# Altium schematic sheet [8]-RK3399 SDRAM Page.SchDoc: RK3399 SOM Board Design V1.0
size A3; Author: ABC; Organization: Altium Limited; Address1: L3, 12a Rodborough Rd; Address2: Frenchs Forest; Address3: NSW; Address4: Australia 2086; DocumentNumber: 10; SheetNumber: 10; SheetTotal: 21; PROJECT CODE: A_V1.0
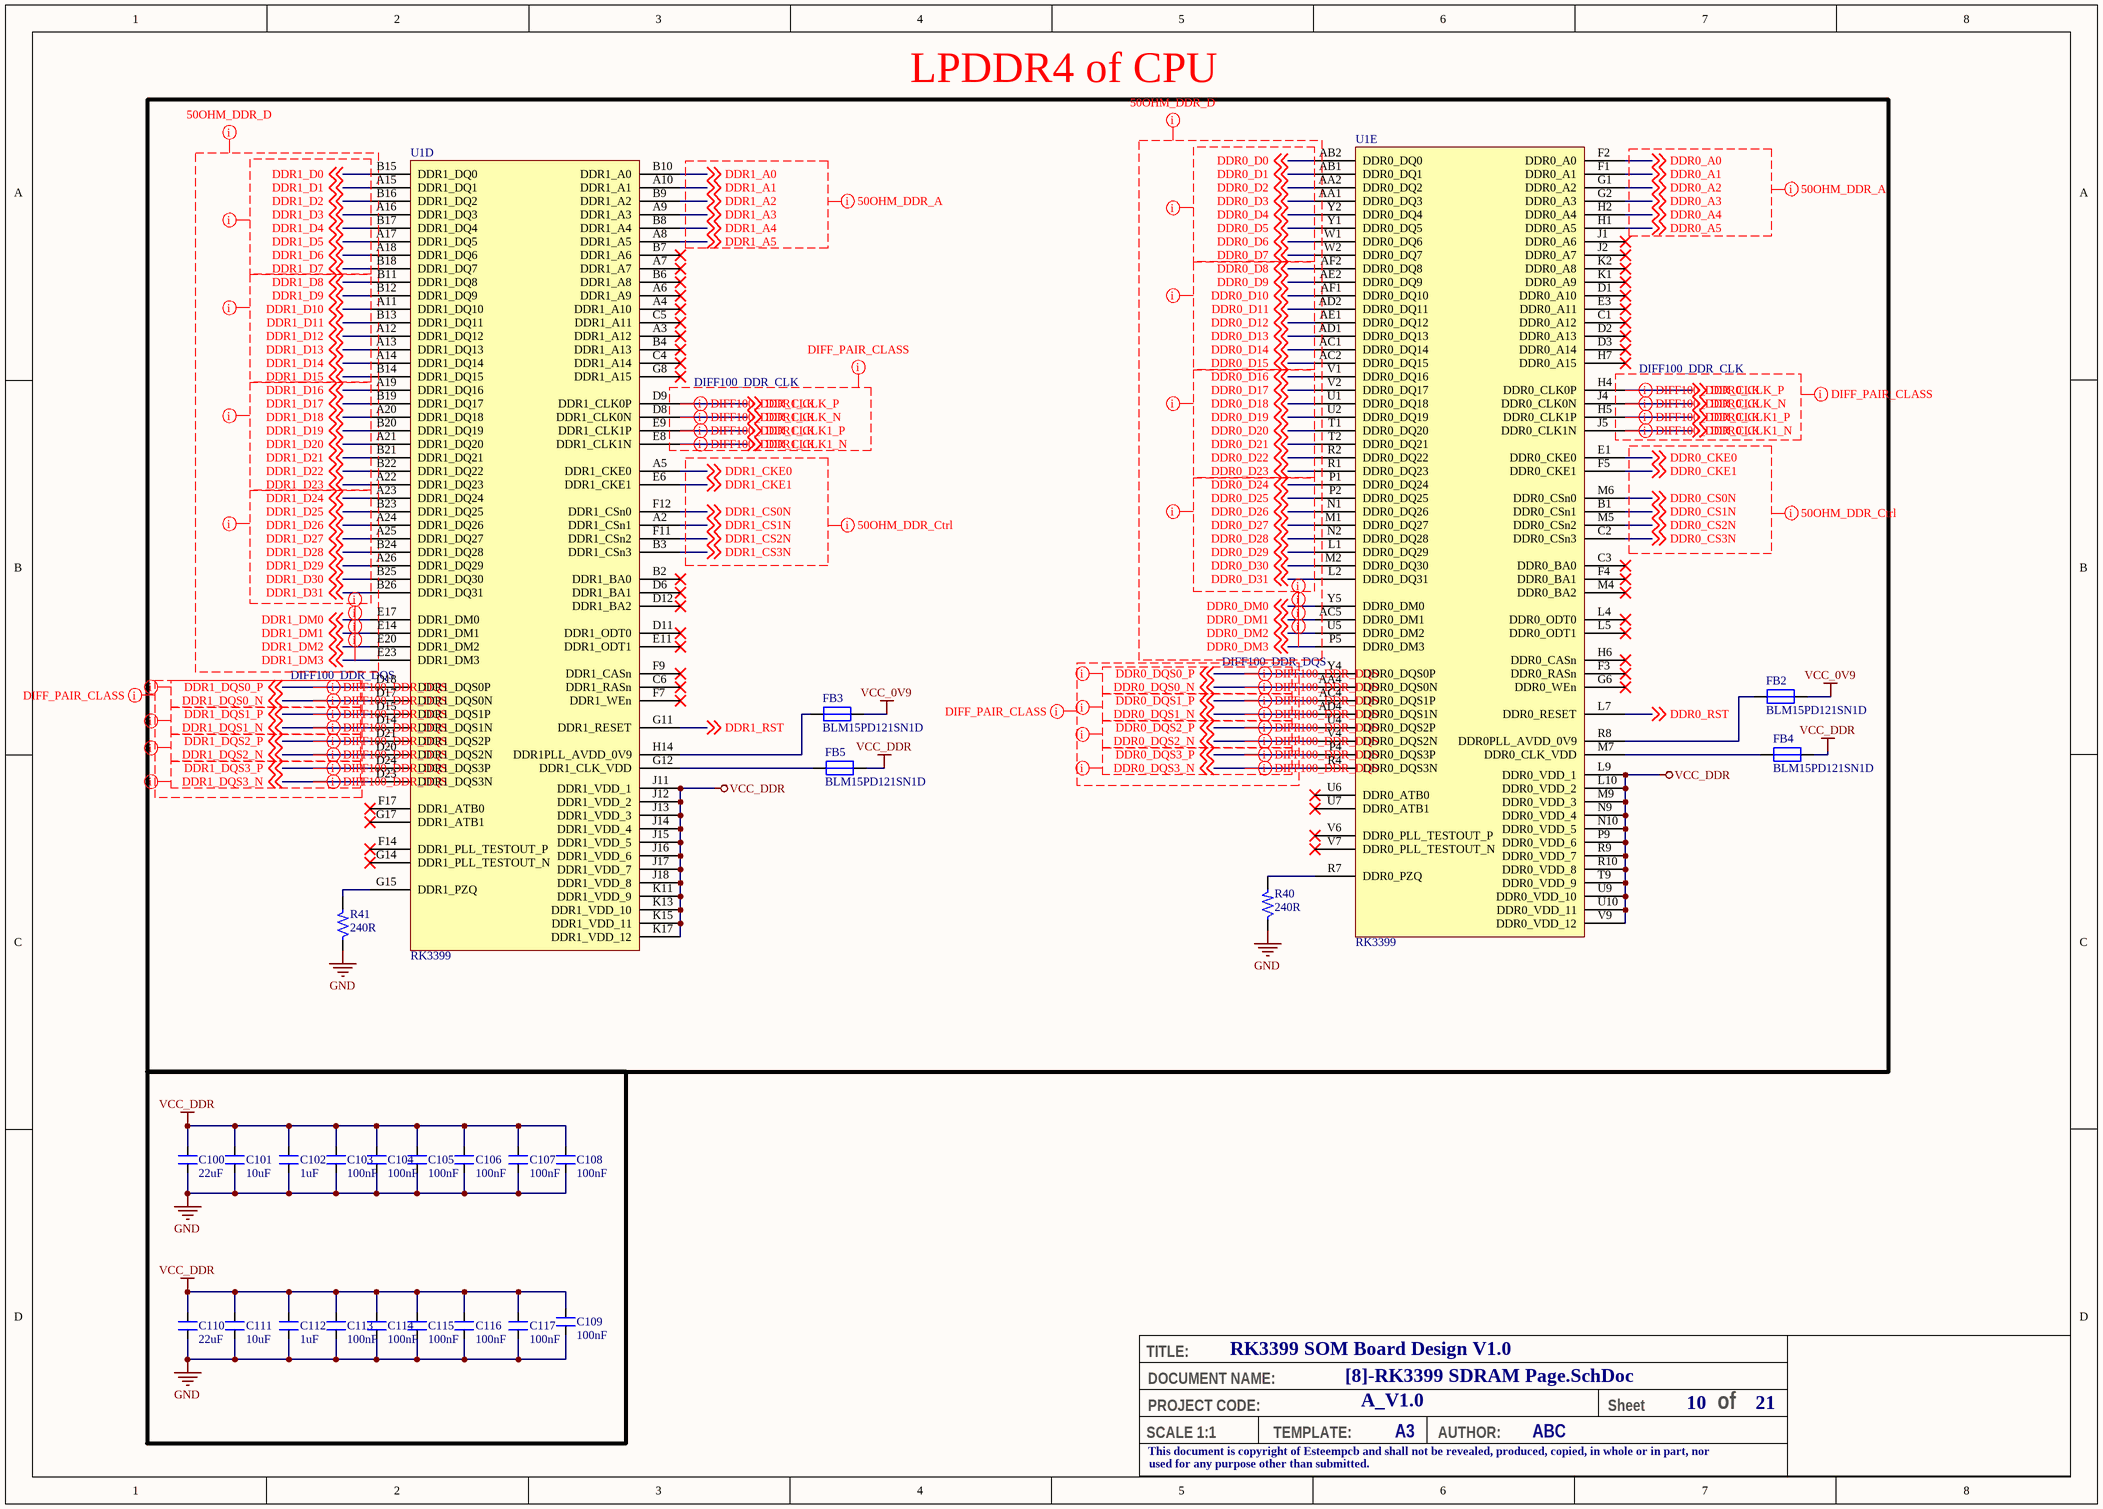
[diagram p0: [8]-RK3399 SDRAM Page.SchDoc]

## Parts
C100  22uF  [CAP_0402]
C101  10uF  [CAP_0402]
C102  1uF  [CAP_0201]
C103  100nF  [CAP_0201]
C104  100nF  [CAP_0201]
C105  100nF  [CAP_0201]
C106  100nF  [CAP_0201]
C107  100nF  [CAP_0201]
C108  100nF  [CAP_0201]
C109  100nF  [CAP_0201]
C110  22uF  [CAP_0402]
C111  10uF  [CAP_0402]
C112  1uF  [CAP_0201]
C113  100nF  [CAP_0201]
C114  100nF  [CAP_0201]
C115  100nF  [CAP_0201]
C116  100nF  [CAP_0201]
C117  100nF  [CAP_0201]
FB2  BLM15PD121SN1D  [RES_0402]
FB3  BLM15PD121SN1D  [RES_0402]
FB4  BLM15PD121SN1D  [RES_0402]
FB5  BLM15PD121SN1D  [RES_0402]
R40  240R  [RES_0201]
R41  240R  [RES_0201]
U1  RK3399  [FBGA828_23_826X826]  (parts D,E of 24)

## Blocks framed on the sheet
LPDDR4 of CPU: FB2-FB5 R40 R41 U1

## Nets
GND: C100.1 C101.1 C102.1 C103.1 C104.1 C105.1 C106.1 C107.1 C108.1 C109.1 C110.1 C111.1 C112.1 C113.1 C114.1 C115.1 C116.1 C117.1 R40.1 R41.1
VCC_0V9: FB2.2 FB3.2
VCC_DDR: C100.2 C101.2 C102.2 C103.2 C104.2 C105.2 C106.2 C107.2 C108.2 C109.2 C110.2 C111.2 C112.2 C113.2 C114.2 C115.2 C116.2 C117.2 FB4.2 FB5.2 U1.J11(DDR1_VDD_1) U1.J12(DDR1_VDD_2) U1.J13(DDR1_VDD_3) U1.J14(DDR1_VDD_4) U1.J15(DDR1_VDD_5) U1.J16(DDR1_VDD_6) U1.J17(DDR1_VDD_7) U1.J18(DDR1_VDD_8) U1.K11(DDR1_VDD_9) U1.K13(DDR1_VDD_10) U1.K15(DDR1_VDD_11) U1.K17(DDR1_VDD_12) U1.L9(DDR0_VDD_1) U1.L10(DDR0_VDD_2) U1.M9(DDR0_VDD_3) U1.N9(DDR0_VDD_4) U1.N10(DDR0_VDD_5) U1.P9(DDR0_VDD_6) U1.R9(DDR0_VDD_7) U1.R10(DDR0_VDD_8) U1.T9(DDR0_VDD_9) U1.U9(DDR0_VDD_10) U1.U10(DDR0_VDD_11) U1.V9(DDR0_VDD_12)
DDR0_A0: U1.F2(DDR0_A0) ; off-sheet DDR0_A0
DDR0_A1: U1.F1(DDR0_A1) ; off-sheet DDR0_A1
DDR0_A2: U1.G1(DDR0_A2) ; off-sheet DDR0_A2
DDR0_A3: U1.G2(DDR0_A3) ; off-sheet DDR0_A3
DDR0_A4: U1.H2(DDR0_A4) ; off-sheet DDR0_A4
DDR0_A5: U1.H1(DDR0_A5) ; off-sheet DDR0_A5
DDR0_CKE0: U1.E1(DDR0_CKE0) ; off-sheet DDR0_CKE0
DDR0_CKE1: U1.F5(DDR0_CKE1) ; off-sheet DDR0_CKE1
DDR0_CLK1_N: U1.J5(DDR0_CLK1N) ; off-sheet DDR0_CLK1_N
DDR0_CLK1_P: U1.H5(DDR0_CLK1P) ; off-sheet DDR0_CLK1_P
DDR0_CLK_N: U1.J4(DDR0_CLK0N) ; off-sheet DDR0_CLK_N
DDR0_CLK_P: U1.H4(DDR0_CLK0P) ; off-sheet DDR0_CLK_P
DDR0_CS0N: U1.M6(DDR0_CSn0) ; off-sheet DDR0_CS0N
DDR0_CS1N: U1.B1(DDR0_CSn1) ; off-sheet DDR0_CS1N
DDR0_CS2N: U1.M5(DDR0_CSn2) ; off-sheet DDR0_CS2N
DDR0_CS3N: U1.C2(DDR0_CSn3) ; off-sheet DDR0_CS3N
DDR0_D0: U1.AB2(DDR0_DQ0) ; off-sheet DDR0_D0
DDR0_D1: U1.AB1(DDR0_DQ1) ; off-sheet DDR0_D1
DDR0_D2: U1.AA2(DDR0_DQ2) ; off-sheet DDR0_D2
DDR0_D3: U1.AA1(DDR0_DQ3) ; off-sheet DDR0_D3
DDR0_D4: U1.Y2(DDR0_DQ4) ; off-sheet DDR0_D4
DDR0_D5: U1.Y1(DDR0_DQ5) ; off-sheet DDR0_D5
DDR0_D6: U1.W1(DDR0_DQ6) ; off-sheet DDR0_D6
DDR0_D7: U1.W2(DDR0_DQ7) ; off-sheet DDR0_D7
DDR0_D8: U1.AF2(DDR0_DQ8) ; off-sheet DDR0_D8
DDR0_D9: U1.AE2(DDR0_DQ9) ; off-sheet DDR0_D9
DDR0_D10: U1.AF1(DDR0_DQ10) ; off-sheet DDR0_D10
DDR0_D11: U1.AD2(DDR0_DQ11) ; off-sheet DDR0_D11
DDR0_D12: U1.AE1(DDR0_DQ12) ; off-sheet DDR0_D12
DDR0_D13: U1.AD1(DDR0_DQ13) ; off-sheet DDR0_D13
DDR0_D14: U1.AC1(DDR0_DQ14) ; off-sheet DDR0_D14
DDR0_D15: U1.AC2(DDR0_DQ15) ; off-sheet DDR0_D15
DDR0_D16: U1.V1(DDR0_DQ16) ; off-sheet DDR0_D16
DDR0_D17: U1.V2(DDR0_DQ17) ; off-sheet DDR0_D17
DDR0_D18: U1.U1(DDR0_DQ18) ; off-sheet DDR0_D18
DDR0_D19: U1.U2(DDR0_DQ19) ; off-sheet DDR0_D19
DDR0_D20: U1.T1(DDR0_DQ20) ; off-sheet DDR0_D20
DDR0_D21: U1.T2(DDR0_DQ21) ; off-sheet DDR0_D21
DDR0_D22: U1.R2(DDR0_DQ22) ; off-sheet DDR0_D22
DDR0_D23: U1.R1(DDR0_DQ23) ; off-sheet DDR0_D23
DDR0_D24: U1.P1(DDR0_DQ24) ; off-sheet DDR0_D24
DDR0_D25: U1.P2(DDR0_DQ25) ; off-sheet DDR0_D25
DDR0_D26: U1.N1(DDR0_DQ26) ; off-sheet DDR0_D26
DDR0_D27: U1.M1(DDR0_DQ27) ; off-sheet DDR0_D27
DDR0_D28: U1.N2(DDR0_DQ28) ; off-sheet DDR0_D28
DDR0_D29: U1.L1(DDR0_DQ29) ; off-sheet DDR0_D29
DDR0_D30: U1.M2(DDR0_DQ30) ; off-sheet DDR0_D30
DDR0_D31: U1.L2(DDR0_DQ31) ; off-sheet DDR0_D31
DDR0_DM0: U1.Y5(DDR0_DM0) ; off-sheet DDR0_DM0
DDR0_DM1: U1.AC5(DDR0_DM1) ; off-sheet DDR0_DM1
DDR0_DM2: U1.U5(DDR0_DM2) ; off-sheet DDR0_DM2
DDR0_DM3: U1.P5(DDR0_DM3) ; off-sheet DDR0_DM3
DDR0_DQS0_N: U1.AA4(DDR0_DQS0N) ; off-sheet DDR0_DQS0_N
DDR0_DQS0_P: U1.Y4(DDR0_DQS0P) ; off-sheet DDR0_DQS0_P
DDR0_DQS1_N: U1.AD4(DDR0_DQS1N) ; off-sheet DDR0_DQS1_N
DDR0_DQS1_P: U1.AC4(DDR0_DQS1P) ; off-sheet DDR0_DQS1_P
DDR0_DQS2_N: U1.V4(DDR0_DQS2N) ; off-sheet DDR0_DQS2_N
DDR0_DQS2_P: U1.U4(DDR0_DQS2P) ; off-sheet DDR0_DQS2_P
DDR0_DQS3_N: U1.R4(DDR0_DQS3N) ; off-sheet DDR0_DQS3_N
DDR0_DQS3_P: U1.P4(DDR0_DQS3P) ; off-sheet DDR0_DQS3_P
DDR0_RST: U1.L7(DDR0_RESET) ; off-sheet DDR0_RST
DDR1_A0: U1.B10(DDR1_A0) ; off-sheet DDR1_A0
DDR1_A1: U1.A10(DDR1_A1) ; off-sheet DDR1_A1
DDR1_A2: U1.B9(DDR1_A2) ; off-sheet DDR1_A2
DDR1_A3: U1.A9(DDR1_A3) ; off-sheet DDR1_A3
DDR1_A4: U1.B8(DDR1_A4) ; off-sheet DDR1_A4
DDR1_A5: U1.A8(DDR1_A5) ; off-sheet DDR1_A5
DDR1_CKE0: U1.A5(DDR1_CKE0) ; off-sheet DDR1_CKE0
DDR1_CKE1: U1.E6(DDR1_CKE1) ; off-sheet DDR1_CKE1
DDR1_CLK1_N: U1.E8(DDR1_CLK1N) ; off-sheet DDR1_CLK1_N
DDR1_CLK1_P: U1.E9(DDR1_CLK1P) ; off-sheet DDR1_CLK1_P
DDR1_CLK_N: U1.D8(DDR1_CLK0N) ; off-sheet DDR1_CLK_N
DDR1_CLK_P: U1.D9(DDR1_CLK0P) ; off-sheet DDR1_CLK_P
DDR1_CS0N: U1.F12(DDR1_CSn0) ; off-sheet DDR1_CS0N
DDR1_CS1N: U1.A2(DDR1_CSn1) ; off-sheet DDR1_CS1N
DDR1_CS2N: U1.F11(DDR1_CSn2) ; off-sheet DDR1_CS2N
DDR1_CS3N: U1.B3(DDR1_CSn3) ; off-sheet DDR1_CS3N
DDR1_D0: U1.B15(DDR1_DQ0) ; off-sheet DDR1_D0
DDR1_D1: U1.A15(DDR1_DQ1) ; off-sheet DDR1_D1
DDR1_D2: U1.B16(DDR1_DQ2) ; off-sheet DDR1_D2
DDR1_D3: U1.A16(DDR1_DQ3) ; off-sheet DDR1_D3
DDR1_D4: U1.B17(DDR1_DQ4) ; off-sheet DDR1_D4
DDR1_D5: U1.A17(DDR1_DQ5) ; off-sheet DDR1_D5
DDR1_D6: U1.A18(DDR1_DQ6) ; off-sheet DDR1_D6
DDR1_D7: U1.B18(DDR1_DQ7) ; off-sheet DDR1_D7
DDR1_D8: U1.B11(DDR1_DQ8) ; off-sheet DDR1_D8
DDR1_D9: U1.B12(DDR1_DQ9) ; off-sheet DDR1_D9
DDR1_D10: U1.A11(DDR1_DQ10) ; off-sheet DDR1_D10
DDR1_D11: U1.B13(DDR1_DQ11) ; off-sheet DDR1_D11
DDR1_D12: U1.A12(DDR1_DQ12) ; off-sheet DDR1_D12
DDR1_D13: U1.A13(DDR1_DQ13) ; off-sheet DDR1_D13
DDR1_D14: U1.A14(DDR1_DQ14) ; off-sheet DDR1_D14
DDR1_D15: U1.B14(DDR1_DQ15) ; off-sheet DDR1_D15
DDR1_D16: U1.A19(DDR1_DQ16) ; off-sheet DDR1_D16
DDR1_D17: U1.B19(DDR1_DQ17) ; off-sheet DDR1_D17
DDR1_D18: U1.A20(DDR1_DQ18) ; off-sheet DDR1_D18
DDR1_D19: U1.B20(DDR1_DQ19) ; off-sheet DDR1_D19
DDR1_D20: U1.A21(DDR1_DQ20) ; off-sheet DDR1_D20
DDR1_D21: U1.B21(DDR1_DQ21) ; off-sheet DDR1_D21
DDR1_D22: U1.B22(DDR1_DQ22) ; off-sheet DDR1_D22
DDR1_D23: U1.A22(DDR1_DQ23) ; off-sheet DDR1_D23
DDR1_D24: U1.A23(DDR1_DQ24) ; off-sheet DDR1_D24
DDR1_D25: U1.B23(DDR1_DQ25) ; off-sheet DDR1_D25
DDR1_D26: U1.A24(DDR1_DQ26) ; off-sheet DDR1_D26
DDR1_D27: U1.A25(DDR1_DQ27) ; off-sheet DDR1_D27
DDR1_D28: U1.B24(DDR1_DQ28) ; off-sheet DDR1_D28
DDR1_D29: U1.A26(DDR1_DQ29) ; off-sheet DDR1_D29
DDR1_D30: U1.B25(DDR1_DQ30) ; off-sheet DDR1_D30
DDR1_D31: U1.B26(DDR1_DQ31) ; off-sheet DDR1_D31
DDR1_DM0: U1.E17(DDR1_DM0) ; off-sheet DDR1_DM0
DDR1_DM1: U1.E14(DDR1_DM1) ; off-sheet DDR1_DM1
DDR1_DM2: U1.E20(DDR1_DM2) ; off-sheet DDR1_DM2
DDR1_DM3: U1.E23(DDR1_DM3) ; off-sheet DDR1_DM3
DDR1_DQS0_N: U1.D17(DDR1_DQS0N) ; off-sheet DDR1_DQS0_N
DDR1_DQS0_P: U1.D18(DDR1_DQS0P) ; off-sheet DDR1_DQS0_P
DDR1_DQS1_N: U1.D14(DDR1_DQS1N) ; off-sheet DDR1_DQS1_N
DDR1_DQS1_P: U1.D15(DDR1_DQS1P) ; off-sheet DDR1_DQS1_P
DDR1_DQS2_N: U1.D20(DDR1_DQS2N) ; off-sheet DDR1_DQS2_N
DDR1_DQS2_P: U1.D21(DDR1_DQS2P) ; off-sheet DDR1_DQS2_P
DDR1_DQS3_N: U1.D23(DDR1_DQS3N) ; off-sheet DDR1_DQS3_N
DDR1_DQS3_P: U1.D24(DDR1_DQS3P) ; off-sheet DDR1_DQS3_P
DDR1_RST: U1.G11(DDR1_RESET) ; off-sheet DDR1_RST
NetFB2_1: FB2.1 U1.R8(DDR0PLL_AVDD_0V9)
NetFB3_1: FB3.1 U1.H14(DDR1PLL_AVDD_0V9)
NetFB4_1: FB4.1 U1.M7(DDR0_CLK_VDD)
NetFB5_1: FB5.1 U1.G12(DDR1_CLK_VDD)
NetR40_2: R40.2 U1.R7(DDR0_PZQ)
NetR41_2: R41.2 U1.G15(DDR1_PZQ)

Not connected (* = marked no-connect by the designer): U1 A3(DDR1_A12)* A4(DDR1_A10)* A6(DDR1_A9)* A7(DDR1_A7)* B2(DDR1_BA0)* B4(DDR1_A13)* B6(DDR1_A8)* B7(DDR1_A6)* C1(DDR0_A12)* C3(DDR0_BA0)* C4(DDR1_A14)* C5(DDR1_A11)* C6(DDR1_RASn)* D1(DDR0_A10)* D2(DDR0_A13)* D3(DDR0_A14)* D6(DDR1_BA1)* D11(DDR1_ODT0)* D12(DDR1_BA2)* E3(DDR0_A11)* E11(DDR1_ODT1)* F3(DDR0_RASn)* F4(DDR0_BA1)* F7(DDR1_WEn)* F9(DDR1_CASn)* F14(DDR1_PLL_TESTOUT_P)* F17(DDR1_ATB0)* G6(DDR0_WEn)* G8(DDR1_A15)* G14(DDR1_PLL_TESTOUT_N)* G17(DDR1_ATB1)* H6(DDR0_CASn)* H7(DDR0_A15)* J1(DDR0_A6)* J2(DDR0_A7)* K1(DDR0_A9)* K2(DDR0_A8)* L4(DDR0_ODT0)* L5(DDR0_ODT1)* M4(DDR0_BA2)* U6(DDR0_ATB0)* U7(DDR0_ATB1)* V6(DDR0_PLL_TESTOUT_P)* V7(DDR0_PLL_TESTOUT_N)*

## Layout directives
net class 50OHM_DDR_D: DDR0_D0, DDR0_D1, DDR0_D2, DDR0_D3, DDR0_D4, DDR0_D5, DDR0_D6, DDR0_D7, DDR0_D8, DDR0_D9, DDR0_D10, DDR0_D11, DDR0_D12, DDR0_D13, DDR0_D14, DDR0_D15, DDR0_D16, DDR0_D17, DDR0_D18, DDR0_D19, DDR0_D20, DDR0_D21, DDR0_D22, DDR0_D23, DDR0_D24, DDR0_D25, DDR0_D26, DDR0_D27, DDR0_D28, DDR0_D29, DDR0_D30, DDR0_D31, DDR0_DM0, DDR0_DM1, DDR0_DM2, DDR0_DM3, DDR1_D0, DDR1_D1, DDR1_D2, DDR1_D3, DDR1_D4, DDR1_D5, DDR1_D6, DDR1_D7, DDR1_D8, DDR1_D9, DDR1_D10, DDR1_D11, DDR1_D12, DDR1_D13, DDR1_D14, DDR1_D15, DDR1_D16, DDR1_D17, DDR1_D18, DDR1_D19, DDR1_D20, DDR1_D21, DDR1_D22, DDR1_D23, DDR1_D24, DDR1_D25, DDR1_D26, DDR1_D27, DDR1_D28, DDR1_D29, DDR1_D30, DDR1_D31, DDR1_DM0, DDR1_DM1, DDR1_DM2, DDR1_DM3
net class DDR_G-1: DDR0_D0, DDR0_D1, DDR0_D2, DDR0_D3, DDR0_D4, DDR0_D5, DDR0_D6, DDR0_D7, DDR0_DM0, DDR0_DQS0_N, DDR0_DQS0_P, DDR1_D0, DDR1_D1, DDR1_D2, DDR1_D3, DDR1_D4, DDR1_D5, DDR1_D6, DDR1_D7, DDR1_DM0, DDR1_DQS0_N, DDR1_DQS0_P
net class DDR_G-2: DDR0_D8, DDR0_D9, DDR0_D10, DDR0_D11, DDR0_D12, DDR0_D13, DDR0_D14, DDR0_D15, DDR0_DM1, DDR0_DQS1_N, DDR0_DQS1_P, DDR1_D8, DDR1_D9, DDR1_D10, DDR1_D11, DDR1_D12, DDR1_D13, DDR1_D14, DDR1_D15, DDR1_DM1, DDR1_DQS1_N, DDR1_DQS1_P
net class DDR_G-3: DDR0_D16, DDR0_D17, DDR0_D18, DDR0_D19, DDR0_D20, DDR0_D21, DDR0_D22, DDR0_D23, DDR0_DM2, DDR0_DQS2_N, DDR0_DQS2_P, DDR1_D16, DDR1_D17, DDR1_D18, DDR1_D19, DDR1_D20, DDR1_D21, DDR1_D22, DDR1_D23, DDR1_DM2, DDR1_DQS2_N, DDR1_DQS2_P
net class DDR_G-4: DDR0_D24, DDR0_D25, DDR0_D26, DDR0_D27, DDR0_D28, DDR0_D29, DDR0_D30, DDR0_D31, DDR0_DM3, DDR0_DQS3_N, DDR0_DQS3_P, DDR1_D24, DDR1_D25, DDR1_D26, DDR1_D27, DDR1_D28, DDR1_D29, DDR1_D30, DDR1_D31, DDR1_DM3, DDR1_DQS3_N, DDR1_DQS3_P
differential pair; differential pair class DIFF100_DDR_DQS: DDR0_DQS0_N, DDR0_DQS0_P, DDR0_DQS1_N, DDR0_DQS1_P, DDR0_DQS2_N, DDR0_DQS2_P, DDR0_DQS3_N, DDR0_DQS3_P, DDR1_DQS0_N, DDR1_DQS0_P, DDR1_DQS1_N, DDR1_DQS1_P, DDR1_DQS2_N, DDR1_DQS2_P, DDR1_DQS3_N, DDR1_DQS3_P
net class 50OHM_DDR_A: DDR0_A0, DDR0_A1, DDR0_A2, DDR0_A3, DDR0_A4, DDR0_A5, DDR1_A0, DDR1_A1, DDR1_A2, DDR1_A3, DDR1_A4, DDR1_A5
net class 50OHM_DDR_Ctrl: DDR0_CKE0, DDR0_CKE1, DDR0_CS0N, DDR0_CS1N, DDR0_CS2N, DDR0_CS3N, DDR1_CKE0, DDR1_CKE1, DDR1_CS0N, DDR1_CS1N, DDR1_CS2N, DDR1_CS3N
differential pair; differential pair class DIFF100_DDR_CLK: DDR0_CLK1_N, DDR0_CLK1_P, DDR0_CLK_N, DDR0_CLK_P, DDR1_CLK1_N, DDR1_CLK1_P, DDR1_CLK_N, DDR1_CLK_P
net class DIFF_PAIR_CLASS: DDR0_CLK1_N, DDR0_CLK1_P, DDR0_CLK_N, DDR0_CLK_P, DDR0_DQS0_N, DDR0_DQS0_P, DDR0_DQS1_N, DDR0_DQS1_P, DDR0_DQS2_N, DDR0_DQS2_P, DDR0_DQS3_N, DDR0_DQS3_P, DDR1_CLK1_N, DDR1_CLK1_P, DDR1_CLK_N, DDR1_CLK_P, DDR1_DQS0_N, DDR1_DQS0_P, DDR1_DQS1_N, DDR1_DQS1_P, DDR1_DQS2_N, DDR1_DQS2_P, DDR1_DQS3_N, DDR1_DQS3_P

## Notes on the sheet
- TITLE:
- DOCUMENT NAME:
- SCALE 1:1
- This document is copyright of Esteempcb and shall not be revealed, produced, copied, in whole or in part, nor
- PROJECT CODE:
- TEMPLATE:
- A3
- AUTHOR:
- Sheet
- of
- used for any purpose other than submitted.

## Library data of the parts
C100 C110 = CAP_22uF-6.3V-20%-0402: 22µF ±20% 6.3V Ceramic Capacitor X5R 0402 (1005 Metric) /; Manufacturer: Murata Electronics; Manufacturer Part Number: CL05A226MQ5N6J8; Case/Package: 0402; Supplier-1: Digikey
C101 C111 = CAP_10uF-10V-20%-0402: 10µF ±20% 10V Ceramic Capacitor X5R 0402 (1005 Metric) /; Manufacturer Part Number: CL05A106MP5NUNC; Manufacturer: Samsung Electro-Mechanics; Case/Package: 0402; Supplier-1: Digikey
C102 C112 = CAP_1uF-16V-10%-0201: 1µF ±20% 16V Ceramic Capacitor X5R 0201 (0603 Metric) /; Manufacturer: Samsung Electro-Mechanics; Manufacturer Part Number: CL03A105MO3NRNH; Case/Package: 0201; Supplier-1: Digikey
C103-C109 C113-C117 = CAP_100nF-25V-10%-0201: 0.1µF ±10% 25V Ceramic Capacitor X5R 0201 (0603 Metric) /; Manufacturer: TDK Corporation; Manufacturer Part Number: C0603X5R1E104K030BB; Case/Package: 0201; Supplier-1: Digikey
FB2-FB5 = FB_120R-1.3A-100Mhz-0402: 120 Ohms @ 100MHz 1 Power Line Ferrite Bead 0402 (1005 Metric) 1.3A 90mOhm; Manufacturer: Murata Electronics; Mnaufacturer Part Number: BLM15PD121SN1D; Case/Package: 0402; Supplier-1: Digikey
R40 R41 = RES_240R-0.05W-1%-0201: 240 Ohms ±1% 0.05W, 1/20W Chip Resistor 0201 (0603 Metric) Thick Film /; Manufacturer: Yageo; Manufacturer Part Number: RC0201FR-07240RL; Case/Package: 0201; Supplier-1: Digikey
U1 = IC_RK3399-FCBGA828: RK3399 is a low power, high performance processor for computing, personal mobile.; Manufacturer: Rockchip; Manufacturer Part Number: RK3399; Case/Package: FCBGA828; Supplier-1: Rockchip